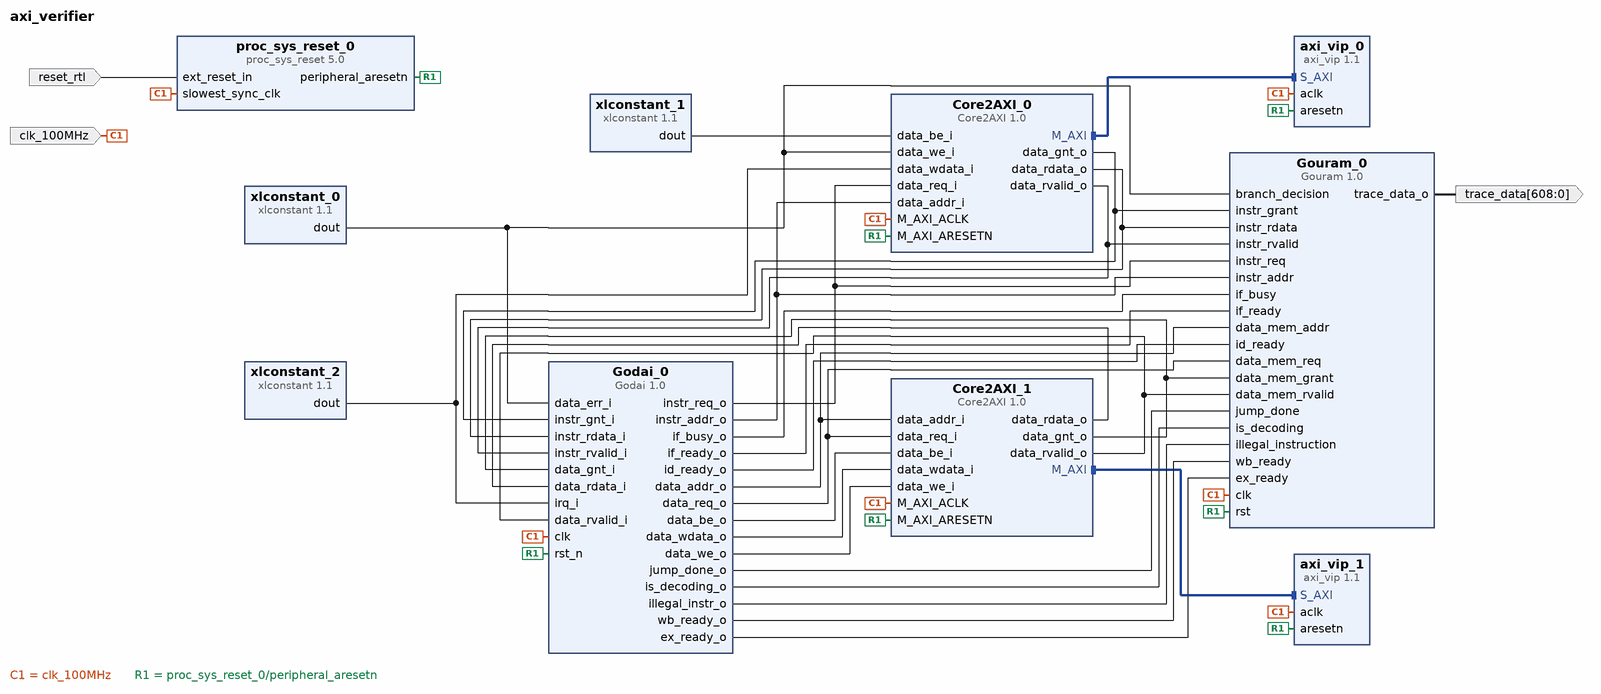
[diagram p0: block diagram of the top level]
# Vivado block design axi_verifier, xc7vx485tffg1761-2, Vivado 2018.2
create_bd_design axi_verifier

create_bd_port -dir I -type clk clk_100MHz
set_property -dict {CONFIG.FREQ_HZ 100000000} [get_bd_ports clk_100MHz]
create_bd_port -dir I -type rst reset_rtl
set_property -dict {CONFIG.POLARITY ACTIVE_LOW} [get_bd_ports reset_rtl]
create_bd_port -dir O -from 608 -to 0 -type data trace_data

create_bd_cell -type ip -vlnv jonathan-rainer.com:Kuuga:Core2AXI:1.0 Core2AXI_0
set_property -dict {CONFIG.C_M_TARGET_SLAVE_BASE_ADDR 0x00000000} [get_bd_cells Core2AXI_0]
create_bd_cell -type ip -vlnv jonathan-rainer.com:Kuuga:Core2AXI:1.0 Core2AXI_1
set_property -dict {CONFIG.C_M_TARGET_SLAVE_BASE_ADDR 0x00000000} [get_bd_cells Core2AXI_1]
create_bd_cell -type ip -vlnv jonathan-rainer.com:Kuuga:Godai:1.0 Godai_0
create_bd_cell -type ip -vlnv xilinx.com:ip:axi_vip:1.1 axi_vip_0
set_property -dict {CONFIG.INTERFACE_MODE SLAVE} [get_bd_cells axi_vip_0]
create_bd_cell -type ip -vlnv xilinx.com:ip:axi_vip:1.1 axi_vip_1
set_property -dict {CONFIG.INTERFACE_MODE SLAVE} [get_bd_cells axi_vip_1]
create_bd_cell -type ip -vlnv xilinx.com:ip:proc_sys_reset:5.0 proc_sys_reset_0
create_bd_cell -type ip -vlnv xilinx.com:ip:xlconstant:1.1 xlconstant_0
set_property -dict {CONFIG.CONST_VAL 0} [get_bd_cells xlconstant_0]
create_bd_cell -type ip -vlnv xilinx.com:ip:xlconstant:1.1 xlconstant_1
set_property -dict {CONFIG.CONST_WIDTH 4 CONFIG.CONST_VAL 0} [get_bd_cells xlconstant_1]
create_bd_cell -type ip -vlnv xilinx.com:ip:xlconstant:1.1 xlconstant_2
set_property -dict {CONFIG.CONST_WIDTH 32 CONFIG.CONST_VAL 0} [get_bd_cells xlconstant_2]
create_bd_cell -type ip -vlnv jonathan-rainer.com:Kuuga:Gouram:1.0 Gouram_0

# ---- connections ----

connect_bd_intf_net [get_bd_intf_pins Core2AXI_0/M_AXI] [get_bd_intf_pins axi_vip_0/S_AXI]
connect_bd_intf_net [get_bd_intf_pins Core2AXI_1/M_AXI] [get_bd_intf_pins axi_vip_1/S_AXI]
connect_bd_net [get_bd_pins Core2AXI_0/data_gnt_o] [get_bd_pins Godai_0/instr_gnt_i] [get_bd_pins Gouram_0/instr_grant]
connect_bd_net [get_bd_pins Core2AXI_0/data_rdata_o] [get_bd_pins Godai_0/instr_rdata_i] [get_bd_pins Gouram_0/instr_rdata]
connect_bd_net [get_bd_pins Core2AXI_0/data_rvalid_o] [get_bd_pins Godai_0/instr_rvalid_i] [get_bd_pins Gouram_0/instr_rvalid]
connect_bd_net [get_bd_pins Core2AXI_1/data_gnt_o] [get_bd_pins Godai_0/data_gnt_i] [get_bd_pins Gouram_0/data_mem_grant]
connect_bd_net [get_bd_pins Core2AXI_1/data_rdata_o] [get_bd_pins Godai_0/data_rdata_i]
connect_bd_net [get_bd_pins Core2AXI_1/data_rvalid_o] [get_bd_pins Godai_0/data_rvalid_i] [get_bd_pins Gouram_0/data_mem_rvalid]
connect_bd_net [get_bd_pins Godai_0/data_addr_o] [get_bd_pins Core2AXI_1/data_addr_i] [get_bd_pins Gouram_0/data_mem_addr]
connect_bd_net [get_bd_pins Godai_0/data_be_o] [get_bd_pins Core2AXI_1/data_be_i]
connect_bd_net [get_bd_pins Godai_0/data_req_o] [get_bd_pins Core2AXI_1/data_req_i] [get_bd_pins Gouram_0/data_mem_req]
connect_bd_net [get_bd_pins Godai_0/data_wdata_o] [get_bd_pins Core2AXI_1/data_wdata_i]
connect_bd_net [get_bd_pins Godai_0/data_we_o] [get_bd_pins Core2AXI_1/data_we_i]
connect_bd_net [get_bd_pins Godai_0/instr_req_o] [get_bd_pins Core2AXI_0/data_req_i] [get_bd_pins Gouram_0/instr_req]
connect_bd_net [get_bd_ports clk_100MHz] \
  [get_bd_pins Core2AXI_0/M_AXI_ACLK] [get_bd_pins Core2AXI_1/M_AXI_ACLK] [get_bd_pins Godai_0/clk] \
  [get_bd_pins axi_vip_0/aclk] [get_bd_pins axi_vip_1/aclk] [get_bd_pins proc_sys_reset_0/slowest_sync_clk] \
  [get_bd_pins Gouram_0/clk]
connect_bd_net [get_bd_pins proc_sys_reset_0/peripheral_aresetn] \
  [get_bd_pins Core2AXI_0/M_AXI_ARESETN] [get_bd_pins Core2AXI_1/M_AXI_ARESETN] [get_bd_pins Godai_0/rst_n] \
  [get_bd_pins axi_vip_0/aresetn] [get_bd_pins axi_vip_1/aresetn] [get_bd_pins Gouram_0/rst]
connect_bd_net [get_bd_ports reset_rtl] [get_bd_pins proc_sys_reset_0/ext_reset_in]
connect_bd_net [get_bd_pins xlconstant_0/dout] \
  [get_bd_pins Core2AXI_0/data_we_i] [get_bd_pins Godai_0/data_err_i] [get_bd_pins Gouram_0/branch_decision]
connect_bd_net [get_bd_pins xlconstant_1/dout] [get_bd_pins Core2AXI_0/data_be_i]
connect_bd_net [get_bd_pins xlconstant_2/dout] [get_bd_pins Core2AXI_0/data_wdata_i] [get_bd_pins Godai_0/irq_i]
connect_bd_net [get_bd_pins Godai_0/if_busy_o] [get_bd_pins Gouram_0/if_busy]
connect_bd_net [get_bd_pins Godai_0/if_ready_o] [get_bd_pins Gouram_0/if_ready]
connect_bd_net [get_bd_pins Godai_0/instr_addr_o] [get_bd_pins Gouram_0/instr_addr] [get_bd_pins Core2AXI_0/data_addr_i]
connect_bd_net [get_bd_pins Godai_0/id_ready_o] [get_bd_pins Gouram_0/id_ready]
connect_bd_net [get_bd_pins Godai_0/jump_done_o] [get_bd_pins Gouram_0/jump_done]
connect_bd_net [get_bd_pins Godai_0/is_decoding_o] [get_bd_pins Gouram_0/is_decoding]
connect_bd_net [get_bd_pins Godai_0/illegal_instr_o] [get_bd_pins Gouram_0/illegal_instruction]
connect_bd_net [get_bd_pins Godai_0/wb_ready_o] [get_bd_pins Gouram_0/wb_ready]
connect_bd_net [get_bd_pins Godai_0/ex_ready_o] [get_bd_pins Gouram_0/ex_ready]
connect_bd_net [get_bd_pins Gouram_0/trace_data_o] [get_bd_ports trace_data]

# ---- address map ----
assign_bd_address -offset 0x00000000 -range 64K -target_address_space [get_bd_addr_spaces Core2AXI_0/M_AXI] [get_bd_addr_segs axi_vip_0/S_AXI/Reg]
assign_bd_address -offset 0x00000000 -range 64K -target_address_space [get_bd_addr_spaces Core2AXI_1/M_AXI] [get_bd_addr_segs axi_vip_1/S_AXI/Reg]

validate_bd_design
save_bd_design
